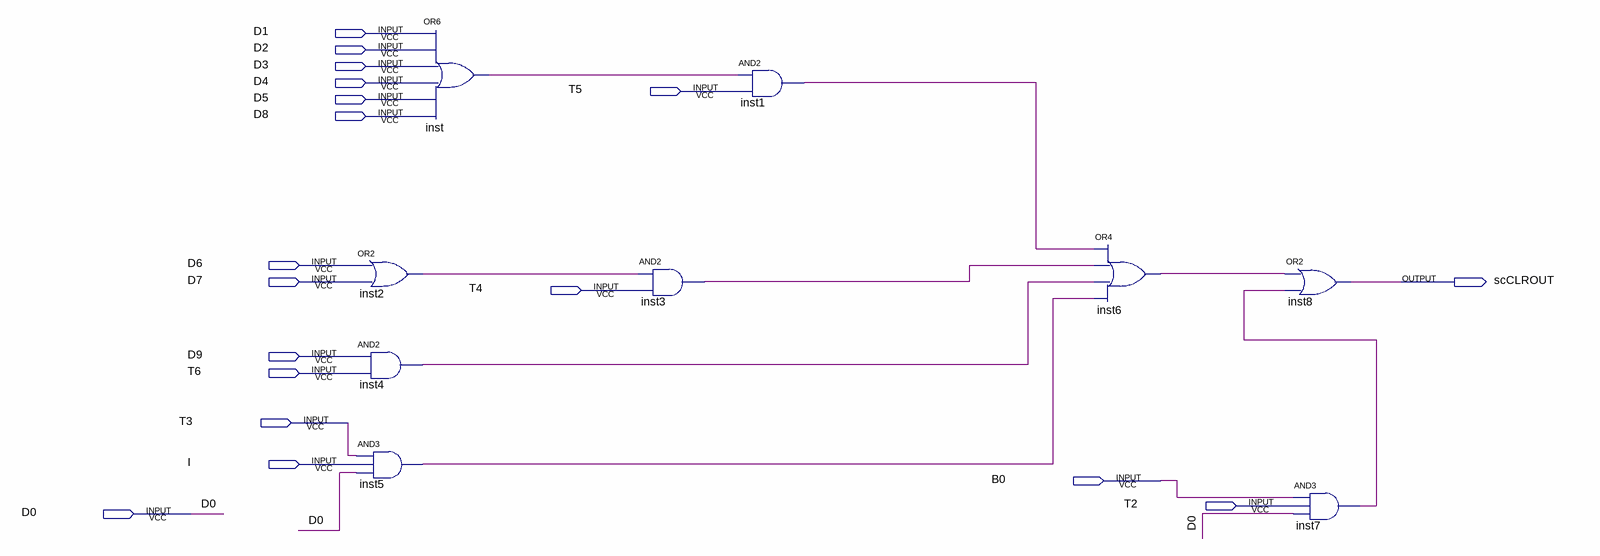
[diagram p0: schematic sheet]
// Quartus schematic scClear.bdf as structural Verilog: 9 symbols, 18 pins
module scClear (
  input  D1,
  input  D2,
  input  D3,
  input  D4,
  input  T5,
  input  D5,
  input  D8,
  input  D6,
  input  D7,
  input  T4,
  input  D9,
  input  T6,
  input  T3,
  input  I,
  input  B0,
  input  T2,
  input  D0,
  output scCLROUT
);

  wire inst1_out, inst2_out, inst3_out, inst4_out, inst5_out, inst6_out, inst7_out, inst_out;

  or inst2 (inst2_out, D6, D7);
  and inst4 (inst4_out, D9, T6);
  and inst5 (inst5_out, T3, I, D0);
  or inst (inst_out, D1, D2, D3, D4, D5, D8);
  and inst3 (inst3_out, inst2_out, T4);
  and inst1 (inst1_out, inst_out, T5);
  or inst6 (inst6_out, inst1_out, inst3_out, inst4_out, inst5_out);
  or inst8 (scCLROUT, inst6_out, inst7_out);
  and inst7 (inst7_out, B0, T2, D0);
endmodule
